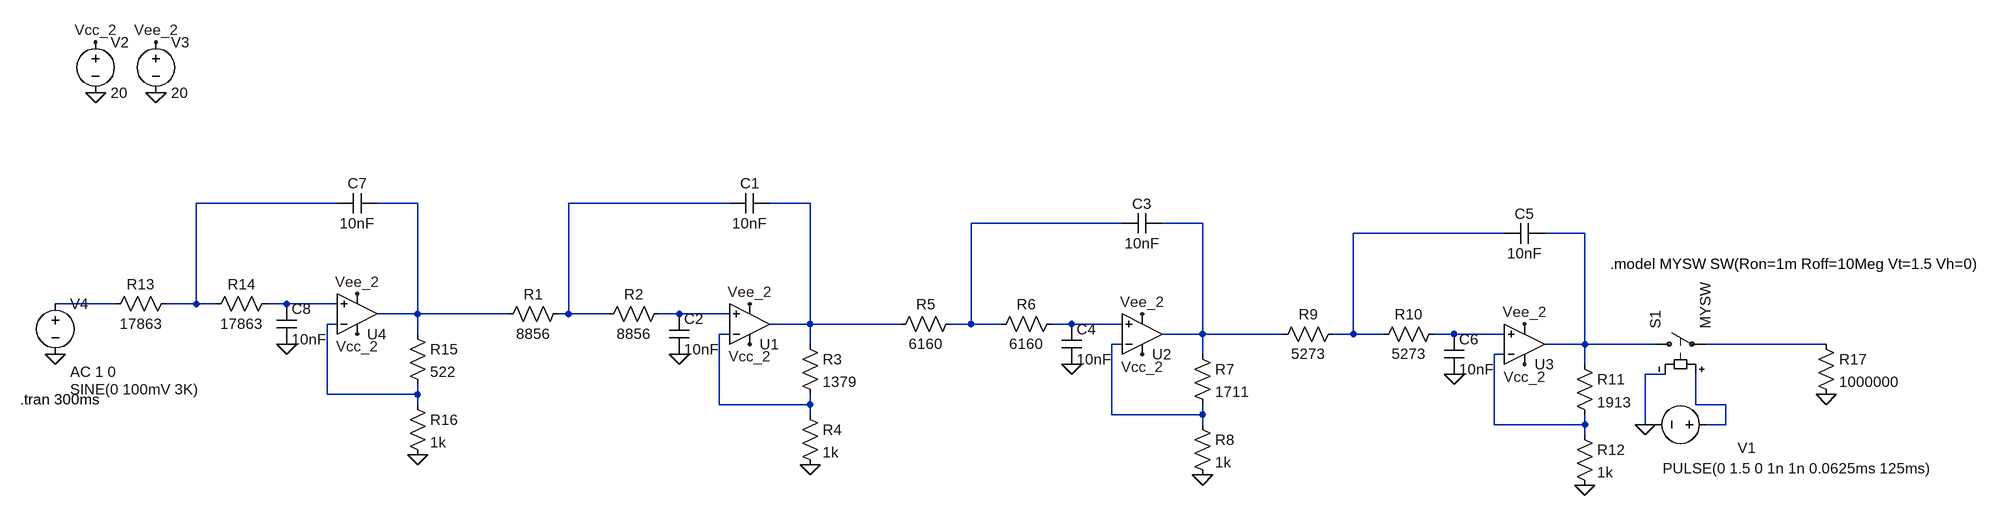
[diagram p0: schematic Ejercicio_7.asc]
Ejercicio_7.asc, the LTspice schematic file:
Version 4
SHEET 1 2204 680
WIRE -480 -128 -704 -128
WIRE -352 -128 -416 -128
WIRE 144 -128 -112 -128
WIRE 272 -128 208 -128
WIRE 768 -96 528 -96
WIRE 896 -96 832 -96
WIRE 1376 -80 1136 -80
WIRE 1504 -80 1440 -80
WIRE -832 32 -928 32
WIRE -704 32 -704 -128
WIRE -704 32 -752 32
WIRE -672 32 -704 32
WIRE -560 32 -592 32
WIRE -480 32 -560 32
WIRE -352 48 -352 -128
WIRE -352 48 -416 48
WIRE -208 48 -352 48
WIRE -112 48 -112 -128
WIRE -112 48 -128 48
WIRE -48 48 -112 48
WIRE 64 48 32 48
WIRE 144 48 64 48
WIRE -480 64 -496 64
WIRE 272 64 272 -128
WIRE 272 64 208 64
WIRE 416 64 272 64
WIRE 528 64 528 -96
WIRE 528 64 496 64
WIRE 576 64 528 64
WIRE 688 64 656 64
WIRE 768 64 688 64
WIRE -352 80 -352 48
WIRE 144 80 128 80
WIRE 896 80 896 -96
WIRE 896 80 832 80
WIRE 1024 80 896 80
WIRE 1136 80 1136 -80
WIRE 1136 80 1104 80
WIRE 1184 80 1136 80
WIRE 1296 80 1264 80
WIRE 1376 80 1296 80
WIRE 272 96 272 64
WIRE 768 96 752 96
WIRE 1504 96 1504 -80
WIRE 1504 96 1440 96
WIRE 1616 96 1504 96
WIRE 1888 96 1696 96
WIRE 896 112 896 80
WIRE 1376 112 1360 112
WIRE 1504 128 1504 96
WIRE 1632 144 1600 144
WIRE -496 176 -496 64
WIRE -352 176 -352 160
WIRE -352 176 -496 176
WIRE -352 192 -352 176
WIRE 128 192 128 80
WIRE 272 192 272 176
WIRE 272 192 128 192
WIRE 1680 192 1680 144
WIRE 1728 192 1680 192
WIRE 272 208 272 192
WIRE 752 208 752 96
WIRE 896 208 896 192
WIRE 896 208 752 208
WIRE 896 224 896 208
WIRE 1360 224 1360 112
WIRE 1504 224 1504 208
WIRE 1504 224 1360 224
WIRE 1600 224 1600 144
WIRE 1616 224 1600 224
WIRE 1728 224 1728 192
WIRE 1728 224 1696 224
WIRE 1504 240 1504 224
FLAG 64 112 0
FLAG 176 96 Vcc_2
FLAG 176 32 Vee_2
FLAG 272 288 0
FLAG 688 128 0
FLAG 800 112 Vcc_2
FLAG 800 48 Vee_2
FLAG 896 304 0
FLAG 1296 144 0
FLAG 1408 128 Vcc_2
FLAG 1408 64 Vee_2
FLAG 1504 320 0
FLAG -560 96 0
FLAG -448 80 Vcc_2
FLAG -448 16 Vee_2
FLAG -928 112 0
FLAG -352 272 0
FLAG 1600 224 0
FLAG 1888 176 0
FLAG -864 -304 0
FLAG -768 -304 0
FLAG -864 -384 Vcc_2
FLAG -768 -384 Vee_2
SYMBOL OpAmps\\UniversalOpAmp 176 64 M180
SYMATTR InstName U1
SYMBOL cap 208 -144 R90
WINDOW 0 0 32 VBottom 2
WINDOW 3 32 32 VTop 2
SYMATTR InstName C1
SYMATTR Value 10nF
SYMBOL res -112 32 R90
WINDOW 0 0 56 VBottom 2
WINDOW 3 32 56 VTop 2
SYMATTR InstName R1
SYMATTR Value 8856
SYMBOL res 48 32 R90
WINDOW 0 0 56 VBottom 2
WINDOW 3 32 56 VTop 2
SYMATTR InstName R2
SYMATTR Value 8856
SYMBOL cap 48 48 R0
SYMATTR InstName C2
SYMATTR Value 10nF
SYMBOL res 256 80 R0
SYMATTR InstName R3
SYMATTR Value 1379
SYMBOL res 256 192 R0
SYMATTR InstName R4
SYMATTR Value 1k
SYMBOL OpAmps\\UniversalOpAmp 800 80 M180
SYMATTR InstName U2
SYMBOL cap 832 -112 R90
WINDOW 0 0 32 VBottom 2
WINDOW 3 32 32 VTop 2
SYMATTR InstName C3
SYMATTR Value 10nF
SYMBOL res 512 48 R90
WINDOW 0 0 56 VBottom 2
WINDOW 3 32 56 VTop 2
SYMATTR InstName R5
SYMATTR Value 6160
SYMBOL res 672 48 R90
WINDOW 0 0 56 VBottom 2
WINDOW 3 32 56 VTop 2
SYMATTR InstName R6
SYMATTR Value 6160
SYMBOL cap 672 64 R0
SYMATTR InstName C4
SYMATTR Value 10nF
SYMBOL res 880 96 R0
SYMATTR InstName R7
SYMATTR Value 1711
SYMBOL res 880 208 R0
SYMATTR InstName R8
SYMATTR Value 1k
SYMBOL OpAmps\\UniversalOpAmp 1408 96 M180
SYMATTR InstName U3
SYMBOL cap 1440 -96 R90
WINDOW 0 0 32 VBottom 2
WINDOW 3 32 32 VTop 2
SYMATTR InstName C5
SYMATTR Value 10nF
SYMBOL res 1120 64 R90
WINDOW 0 0 56 VBottom 2
WINDOW 3 32 56 VTop 2
SYMATTR InstName R9
SYMATTR Value 5273
SYMBOL res 1280 64 R90
WINDOW 0 0 56 VBottom 2
WINDOW 3 32 56 VTop 2
SYMATTR InstName R10
SYMATTR Value 5273
SYMBOL cap 1280 80 R0
SYMATTR InstName C6
SYMATTR Value 10nF
SYMBOL res 1488 112 R0
SYMATTR InstName R11
SYMATTR Value 1913
SYMBOL res 1488 224 R0
SYMATTR InstName R12
SYMATTR Value 1k
SYMBOL OpAmps\\UniversalOpAmp -448 48 M180
SYMATTR InstName U4
SYMBOL cap -416 -144 R90
WINDOW 0 0 32 VBottom 2
WINDOW 3 32 32 VTop 2
SYMATTR InstName C7
SYMATTR Value 10nF
SYMBOL res -736 16 R90
WINDOW 0 0 56 VBottom 2
WINDOW 3 32 56 VTop 2
SYMATTR InstName R13
SYMATTR Value 17863
SYMBOL res -576 16 R90
WINDOW 0 0 56 VBottom 2
WINDOW 3 32 56 VTop 2
SYMATTR InstName R14
SYMATTR Value 17863
SYMBOL cap -576 32 R0
SYMATTR InstName C8
SYMATTR Value 10nF
SYMBOL voltage -928 16 R0
WINDOW 123 24 124 Left 2
WINDOW 39 0 0 Left 0
WINDOW 3 24 152 Left 2
SYMATTR Value2 AC 1 0
SYMATTR Value SINE(0 100mV 3K)
SYMATTR InstName V4
SYMBOL res -368 64 R0
SYMATTR InstName R15
SYMATTR Value 522
SYMBOL res -368 176 R0
SYMATTR InstName R16
SYMATTR Value 1k
SYMBOL sw 1600 96 R270
SYMATTR InstName S1
SYMATTR Value MYSW
SYMBOL voltage 1712 224 R90
WINDOW 0 52 -50 VBottom 2
WINDOW 3 54 -130 VTop 2
WINDOW 123 0 0 Left 0
WINDOW 39 0 0 Left 0
SYMATTR InstName V1
SYMATTR Value PULSE(0 1.5 0 1n 1n 0.0625ms 125ms)
SYMBOL res 1872 80 R0
SYMATTR InstName R17
SYMATTR Value 1000000
SYMBOL voltage -864 -400 R0
WINDOW 123 0 0 Left 0
WINDOW 39 0 0 Left 0
SYMATTR InstName V2
SYMATTR Value 20
SYMBOL voltage -768 -400 R0
WINDOW 123 0 0 Left 0
WINDOW 39 0 0 Left 0
SYMATTR InstName V3
SYMATTR Value 20
TEXT -984 184 Left 2 !.tran 300ms
TEXT 1544 -32 Left 2 !.model MYSW SW(Ron=1m Roff=10Meg Vt=1.5 Vh=0)

The netlist it stands for:
* Ejercicio_7.asc
XU1 N011 N014 Vcc_2 Vee_2 N004 level1 Avol=1Meg GBW=10Meg Vos=0 En=0 Enk=0 In=0 Ink=0 Rin=500Meg  ; pins In+ In- V+ V- OUT
C1 N004 N003 10nF
R1 N003 N002 8856
R2 N011 N003 8856
C2 N011 0 10nF
R3 N004 N014 1379
R4 N014 0 1k
XU2 N013 N016 Vcc_2 Vee_2 N006 level1 Avol=1Meg GBW=10Meg Vos=0 En=0 Enk=0 In=0 Ink=0 Rin=500Meg  ; pins In+ In- V+ V- OUT
C3 N006 N005 10nF
R5 N005 N004 6160
R6 N013 N005 6160
C4 N013 0 10nF
R7 N006 N016 1711
R8 N016 0 1k
XU3 N015 N018 Vcc_2 Vee_2 N008 level1 Avol=1Meg GBW=10Meg Vos=0 En=0 Enk=0 In=0 Ink=0 Rin=500Meg  ; pins In+ In- V+ V- OUT
C5 N008 N007 10nF
R9 N007 N006 5273
R10 N015 N007 5273
C6 N015 0 10nF
R11 N008 N018 1913
R12 N018 0 1k
XU4 N010 N012 Vcc_2 Vee_2 N002 level1 Avol=1Meg GBW=10Meg Vos=0 En=0 Enk=0 In=0 Ink=0 Rin=500Meg  ; pins In+ In- V+ V- OUT
C7 N002 N001 10nF
R13 N001 N009 17863
R14 N010 N001 17863
C8 N010 0 10nF
V4 N009 0 SINE(0 100mV 3K) AC 1 0
R15 N002 N012 522
R16 N012 0 1k
S1 N008 N017 N019 0 MYSW
V1 N019 0 PULSE(0 1.5 0 1n 1n 0.0625ms 125ms)
R17 N017 0 1000000
V2 Vcc_2 0 20
V3 Vee_2 0 20
.tran 300ms
.model MYSW SW(Ron=1m Roff=10Meg Vt=1.5 Vh=0)
.lib UniversalOpAmp1.lib
.backanno
.end